# Altium project Photoboard (HC-05).PrjPcb
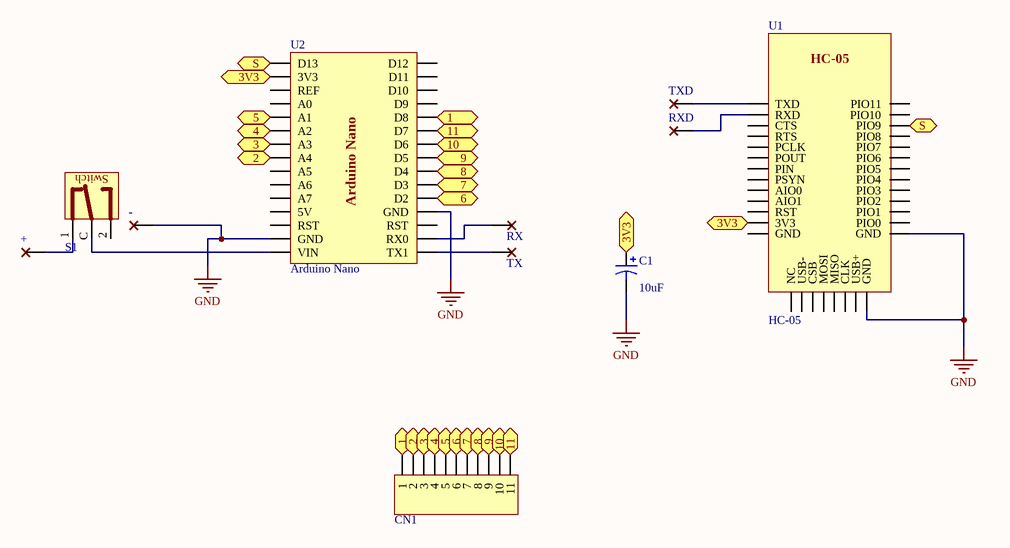
[diagram p0: Photoboard Schematic 1.SchDoc]
1 sheet, 11 parts. Net scope: flat (ports and power ports of the same name join across sheets).
Board file: Photoboard HC-05 PCB.PcbDoc

## Sheet Photoboard Schematic 1.SchDoc
size A

### Parts
+  PAD 1.27x2.54mm  [SMT Pad 1.27x2.54mm]  (value not drawn)
-  PAD 1.27x2.54mm  [SMT Pad 1.27x2.54mm]  (value not drawn)
C1  value 10uF  [C0805]  (hidden comment: Cap Pol3)
CN1  FPC 0.5mm, 11 Pos  [FPC_Connector_11P]  (value not drawn)
RX  PAD 1.27x2.54mm  [SMT Pad 1.27x2.54mm]  (value not drawn)
RXD  PAD 1.27x2.54mm  [SMT Pad 1.27x2.54mm]  (value not drawn)
S1  Slide Switch SMD  [Slide Switch SMD]  (value not drawn)
TX  PAD 1.27x2.54mm  [SMT Pad 1.27x2.54mm]  (value not drawn)
TXD  PAD 1.27x2.54mm  [SMT Pad 1.27x2.54mm]  (value not drawn)
U1  HC-05  [HC-05]
U2  Arduino Nano  [Arduino Nano]

### Ports
1, 2, 3, 3V3, 4, 5, 6, 7, 8, 9, 10, 11, S

### Nets
GND: -.1 C1.2 U1.GND U2.GND
Net+_1: +.1 S1.1
NetC1_1: C1.1 U1.3V3 U2.3V3 ; port 3V3
NetCN1_1: CN1.1 U2.D8 ; port 1
NetCN1_2: CN1.2 U2.A4 ; port 2
NetCN1_3: CN1.3 U2.A3 ; port 3
NetCN1_4: CN1.4 U2.A2 ; port 4
NetCN1_5: CN1.5 U2.A1 ; port 5
NetCN1_6: CN1.6 U2.D2 ; port 6
NetCN1_7: CN1.7 U2.D3 ; port 7
NetCN1_8: CN1.8 U2.D4 ; port 8
NetCN1_9: CN1.9 U2.D5 ; port 9
NetCN1_10: CN1.10 U2.D6 ; port 10
NetCN1_11: CN1.11 U2.D7 ; port 11
NetRX_1: RX.1 U2.RX0
NetRXD_1: RXD.1 U1.RXD
NetS1_C: S1.C U2.VIN
NetTX_1: TX.1 U2.TX1
NetTXD_1: TXD.1 U1.TXD
NetU1_PIO9: U1.PIO9 U2.D13 ; port S

Not connected (* = marked no-connect by the designer): S1 2; U1 AIO0 AIO1 CLK CSB CTS MISO MOSI NC PCLK PIN PIO0 PIO1 PIO2 PIO3 PIO4 PIO5 PIO6 PIO7 PIO8 PIO10 PIO11 POUT PSYN RST RTS USB-; U2 5V A0 A5 A6 A7 D9 D10 D11 D12 REF RST

### Notes on the sheet
- (in symbol Slide Switch SMD) Switch

### Library data of the parts
C1 = Cap Pol3: Polarized Capacitor (Surface Mount); Published: 8-Jun-2000; LatestRevisionDate: 29-May-2009; LatestRevisionNote: IPC-7351 Footprint Added.; PackageReference: C0805; Publisher: Altium Limited; PackageDescription: Chip Capacitor